# Altium schematic sheet Power Regulator.SchDoc
size B; SheetNumber: 0; SheetTotal: 0
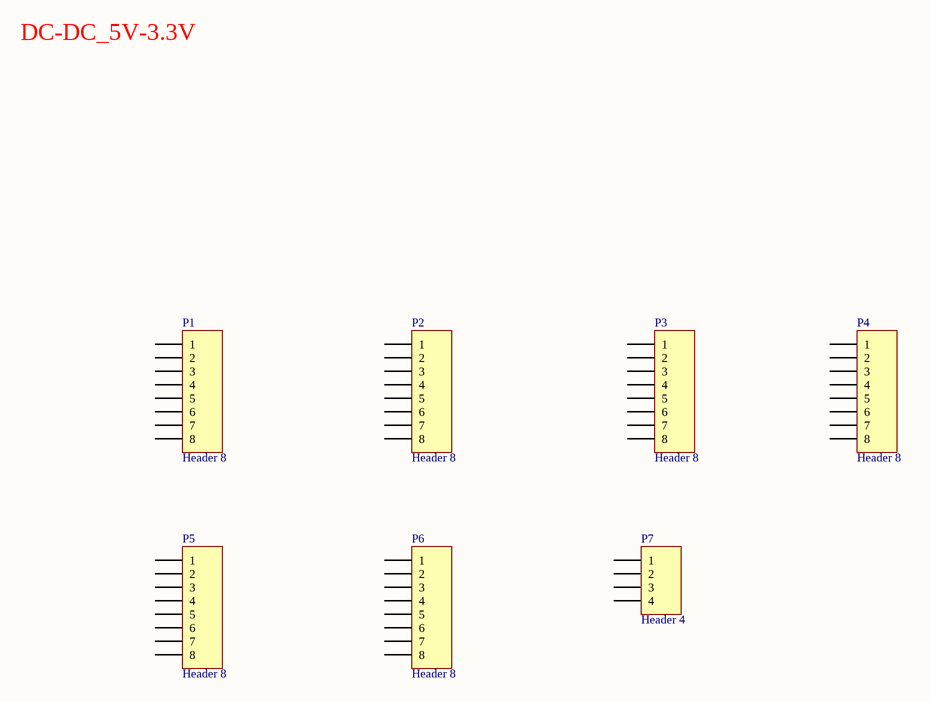
[diagram p0: Power Regulator.SchDoc]

## Parts
P1  Header 8  [HDR1X8]
P2  Header 8  [HDR1X8]
P3  Header 8  [HDR1X8]
P4  Header 8  [HDR1X8]
P5  Header 8  [HDR1X8]
P6  Header 8  [HDR1X8]
P7  Header 4  [HDR1X4]

## Nets

Not connected (* = marked no-connect by the designer): P1 1 2 3 4 5 6 7 8; P2 1 2 3 4 5 6 7 8; P3 1 2 3 4 5 6 7 8; P4 1 2 3 4 5 6 7 8; P5 1 2 3 4 5 6 7 8; P6 1 2 3 4 5 6 7 8; P7 1 2 3 4

## Notes on the sheet
- DC-DC_5V-3.3V

## Library data of the parts
P1-P6 = Header 8: Header, 8-Pin; LatestRevisionDate: 17-Jul-2002; LatestRevisionNote: Re-released for DXP Platform.; Publisher: Altium Limited
P7 = Header 4: Header, 4-Pin; LatestRevisionDate: 17-Jul-2002; LatestRevisionNote: Re-released for DXP Platform.; Publisher: Altium Limited